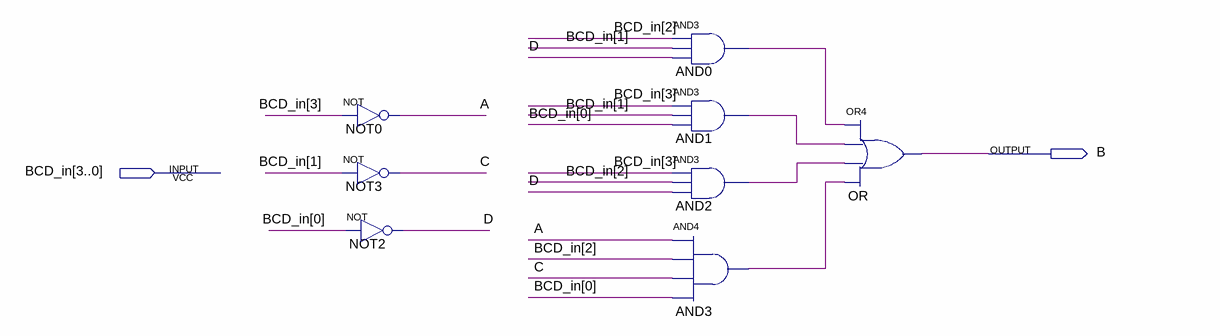
[diagram p0: schematic sheet]
// Quartus schematic DECOD_BCD_B.bdf as structural Verilog: 8 symbols, 2 pins
module DECOD_BCD_B (
  input  [3:0] BCD_in,
  output B
);

  wire A, AND0_out, AND1_out, AND2_out, AND3_out, C, D;

  not NOT0 (A, BCD_in[3]);
  not NOT3 (C, BCD_in[1]);
  not NOT2 (D, BCD_in[0]);
  and AND0 (AND0_out, BCD_in[2], BCD_in[1], D);
  and AND1 (AND1_out, BCD_in[3], BCD_in[1], BCD_in[0]);
  and AND2 (AND2_out, BCD_in[3], BCD_in[2], D);
  and AND3 (AND3_out, A, BCD_in[2], C, BCD_in[0]);
  or OR (B, AND0_out, AND1_out, AND2_out, AND3_out);
endmodule
